# Altium schematic sheet FanController.SchDoc
size A
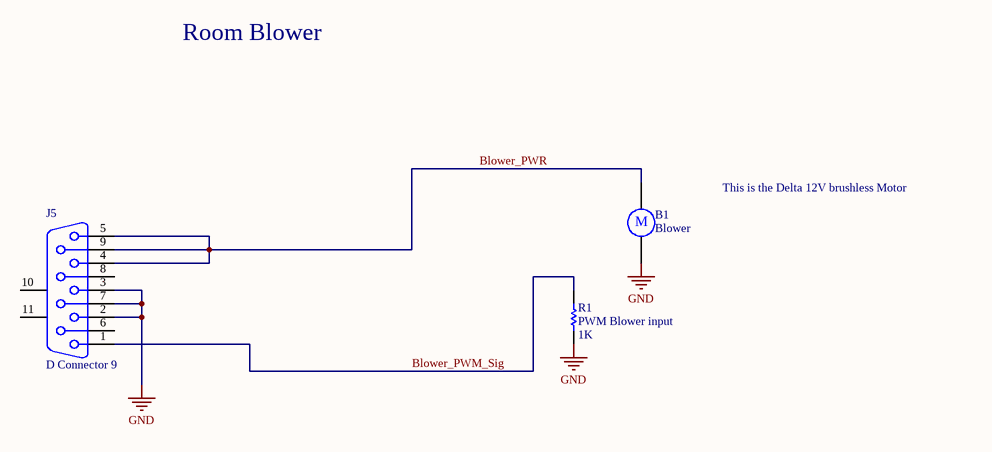
[diagram p0: FanController.SchDoc]

## Parts
B1  Blower  [RB5-10.5]
J5  D Connector 9  [DSUB1.385-2H9]
R1  PWM Blower input  value 1K  [AXIAL-0.3]

## Nets
GND: B1.2 J5.2 J5.3 J5.7 R1.1
Blower_PWM_Sig: J5.1 R1.2
Blower_PWR: B1.1 J5.4 J5.5 J5.9

Not connected (* = marked no-connect by the designer): J5 6 8 10(MH1) 11(MH2)

## Notes on the sheet
- Room Blower
- This is the Delta 12V brushless Motor
- (in symbol Motor) M

## Library data of the parts
B1 = Motor: Motor, General Kind; Published: 24-Mar-1999; LatestRevisionDate: 17-Jul-2002; LatestRevisionNote: Re-released for DXP Platform.; PackageReference: RB5-10.5; Publisher: Altium Limited; PackageDescription: Capacitor (Radial); 2 Leads
J5 = D Connector 9: Receptacle Assembly, 9 Position, Right Angle; PackageDocument: O; Positions: 9; Published: 15-Jun-2001; LatestRevisionDate: 17-Jul-2002; LatestRevisionNote: Re-released for DXP Platform.; DatasheetDocument: 1-Sep-1999; PackageReference: 788750; Publisher: Altium Limited; Orientation: Right Angle; Gender: Receptacle
R1 = Res1: Resistor; Published: 8-Jun-2000; LatestRevisionDate: 17-Jul-2002; LatestRevisionNote: Re-released for DXP Platform.; PackageReference: AXIAL-0.3; Publisher: Altium Limited; PackageDescription: Axial Device, Thru-Hole; 2 Leads; 0.3 in Pin Spacing